# Altium schematic sheet DD2090_4CAM_FFC_TopLevel.SchDoc: =project_title
size Tabloid; PageSetup: Record=PageOptions|CenterHorizontal=True|CenterVertical=True|PrintScale=0.73|XCorrection=1.00|YCorrection=1.00|PrintKind=0|BorderSize=5000000|LeftOffset=0|BottomOffset=0|Orientation=2|PaperLength=1000|PaperWidth=1000|Scale=100|PaperSource=7|PrintQuality=-4|MediaType=1|DitherType=10|PaperKind=A4|PrintScaleMode=1; CompanyName: Luxonis Holding; Organization: Luxonis Holding; Address1: 1925 Harmony Park Drive; Address2: Westminster, CO; Address3: 80234; Address4: United States; SheetNumber: 1; SheetTotal: 12
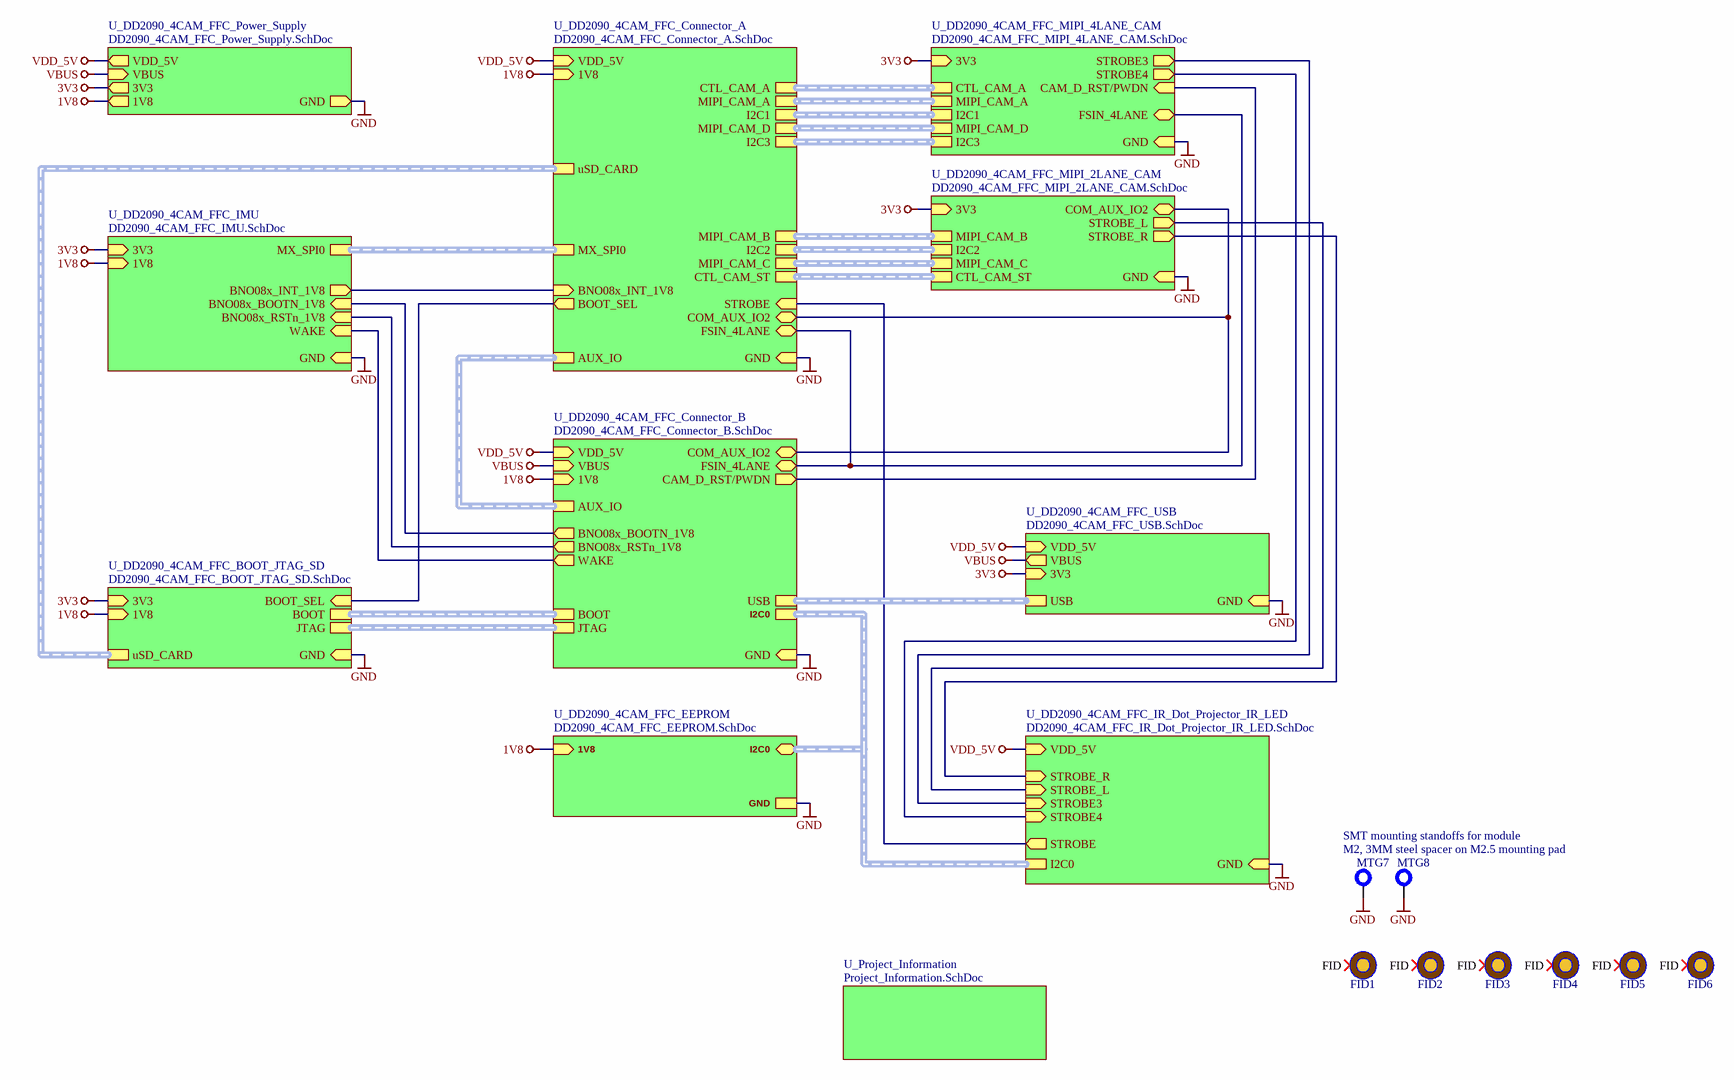
[diagram p0: DD2090_4CAM_FFC_TopLevel.SchDoc]

## Parts
FID1  FIDUCIAL_ROUND_1MM  [FIDUCIAL_ROUND_1MM]  (value not drawn)  (no BOM)
FID2  FIDUCIAL_ROUND_1MM  [FIDUCIAL_ROUND_1MM]  (value not drawn)  (no BOM)
FID3  FIDUCIAL_ROUND_1MM  [FIDUCIAL_ROUND_1MM]  (value not drawn)  (no BOM)
FID4  FIDUCIAL_ROUND_1MM  [FIDUCIAL_ROUND_1MM]  (value not drawn)  (no BOM)
FID5  FIDUCIAL_ROUND_1MM  [FIDUCIAL_ROUND_1MM]  (value not drawn)  (no BOM)
FID6  FIDUCIAL_ROUND_1MM  [FIDUCIAL_ROUND_1MM]  (value not drawn)  (no BOM)
MTG7  M2, 3MM steel spacer on M2.5 mounting pad  [9774030243R]
MTG8  M2, 3MM steel spacer on M2.5 mounting pad  [9774030243R]  (value not drawn)

## Sub-sheets
U_DD2090_4CAM_FFC_BOOT_JTAG_SD = DD2090_4CAM_FFC_BOOT_JTAG_SD.SchDoc: 1V8 (in), GND (in), 3V3 (in), JTAG (harness JTAG), BOOT (harness BOOT), uSD_CARD (harness uSD_CARD), BOOT_SEL (in)
U_DD2090_4CAM_FFC_Connector_A = DD2090_4CAM_FFC_Connector_A.SchDoc: VDD_5V (in), GND (in), 1V8 (in), MIPI_CAM_A (harness MIPI_CAM_A), I2C1 (harness I2C1), MIPI_CAM_B (harness MIPI_CAM_B), I2C2 (harness I2C2), MIPI_CAM_C (harness MIPI_CAM_C), MX_SPI0 (harness MX_SPI0), BNO08x_INT_1V8 (in), CTL_CAM_A (harness CTL_CAM_A), MIPI_CAM_D (harness MIPI_CAM_D), uSD_CARD (harness uSD_CARD), COM_AUX_IO2 (bidir), I2C3 (harness I2C3), AUX_IO (harness AUX_IO), FSIN_4LANE (bidir), BOOT_SEL (out), CTL_CAM_ST (harness CTL_CAM_ST), STROBE (in)
U_DD2090_4CAM_FFC_Connector_B = DD2090_4CAM_FFC_Connector_B.SchDoc: VDD_5V (in), GND (in), VBUS (in), 1V8 (in), USB (harness USB), BNO08x_RSTn_1V8 (out), BNO08x_BOOTN_1V8 (out), BOOT (harness BOOT), JTAG (harness JTAG), CAM_D_RST/PWDN (out), FSIN_4LANE (bidir), COM_AUX_IO2 (bidir), AUX_IO (harness AUX_IO), I2C0 (harness I2C0), WAKE (out)
U_DD2090_4CAM_FFC_EEPROM = DD2090_4CAM_FFC_EEPROM.SchDoc: 1V8 (in), GND, I2C0 (bidir, harness I2C0)
U_DD2090_4CAM_FFC_IMU = DD2090_4CAM_FFC_IMU.SchDoc: BNO08x_BOOTN_1V8 (in), GND (in), 3V3 (in), BNO08x_INT_1V8 (out), BNO08x_RSTn_1V8 (in), 1V8 (in), MX_SPI0 (harness MX_SPI0), WAKE (in)
U_DD2090_4CAM_FFC_IR_Dot_Projector_IR_LED = DD2090_4CAM_FFC_IR_Dot_Projector_IR_LED.SchDoc: I2C0 (harness I2C0), GND (in), VDD_5V (in), STROBE_L (in), STROBE_R (in), STROBE3 (in), STROBE4 (in), STROBE (out)
U_DD2090_4CAM_FFC_MIPI_2LANE_CAM = DD2090_4CAM_FFC_MIPI_2LANE_CAM.SchDoc: MIPI_CAM_B (harness MIPI_CAM_B), I2C2 (harness I2C), MIPI_CAM_C (harness MIPI_CAM_C), GND (in), 3V3 (in), CTL_CAM_ST (harness CTL_CAM_ST), COM_AUX_IO2 (bidir), STROBE_L (out), STROBE_R (out)
U_DD2090_4CAM_FFC_MIPI_4LANE_CAM = DD2090_4CAM_FFC_MIPI_4LANE_CAM.SchDoc: I2C1 (harness I2C1), MIPI_CAM_A (harness MIPI_CAM_A), CTL_CAM_A (harness CTL_CAM_A), GND (in), 3V3 (in), MIPI_CAM_D (harness MIPI_CAM_D), I2C3 (harness I2C3), CAM_D_RST/PWDN (in), FSIN_4LANE (bidir), STROBE3 (out), STROBE4 (out)
U_DD2090_4CAM_FFC_Power_Supply = DD2090_4CAM_FFC_Power_Supply.SchDoc: GND (out), 1V8 (out), VDD_5V (out), 3V3 (out), VBUS (in)
U_DD2090_4CAM_FFC_USB = DD2090_4CAM_FFC_USB.SchDoc: VBUS (out), GND (in), 3V3 (in), VDD_5V (in), USB (harness USB)
U_Project_Information = Project_Information.SchDoc: no entries

## Nets
1V8: sheet U_DD2090_4CAM_FFC_Power_Supply/1V8, sheet U_DD2090_4CAM_FFC_IMU/1V8, sheet U_DD2090_4CAM_FFC_BOOT_JTAG_SD/1V8, sheet U_DD2090_4CAM_FFC_Connector_A/1V8, sheet U_DD2090_4CAM_FFC_Connector_B/1V8, sheet U_DD2090_4CAM_FFC_EEPROM/1V8
3V3: sheet U_DD2090_4CAM_FFC_USB/3V3, sheet U_DD2090_4CAM_FFC_Power_Supply/3V3, sheet U_DD2090_4CAM_FFC_IMU/3V3, sheet U_DD2090_4CAM_FFC_BOOT_JTAG_SD/3V3, sheet U_DD2090_4CAM_FFC_MIPI_2LANE_CAM/3V3, sheet U_DD2090_4CAM_FFC_MIPI_4LANE_CAM/3V3
GND: MTG7.1 MTG8.1 ; sheet U_DD2090_4CAM_FFC_USB/GND, sheet U_DD2090_4CAM_FFC_Power_Supply/GND, sheet U_DD2090_4CAM_FFC_IMU/GND, sheet U_DD2090_4CAM_FFC_BOOT_JTAG_SD/GND, sheet U_DD2090_4CAM_FFC_MIPI_2LANE_CAM/GND, sheet U_DD2090_4CAM_FFC_MIPI_4LANE_CAM/GND, sheet U_DD2090_4CAM_FFC_Connector_A/GND, sheet U_DD2090_4CAM_FFC_Connector_B/GND, sheet U_DD2090_4CAM_FFC_EEPROM/GND, sheet U_DD2090_4CAM_FFC_IR_Dot_Projector_IR_LED/GND
VBUS: sheet U_DD2090_4CAM_FFC_USB/VBUS, sheet U_DD2090_4CAM_FFC_Power_Supply/VBUS, sheet U_DD2090_4CAM_FFC_Connector_B/VBUS
VDD_5V: sheet U_DD2090_4CAM_FFC_USB/VDD_5V, sheet U_DD2090_4CAM_FFC_Power_Supply/VDD_5V, sheet U_DD2090_4CAM_FFC_Connector_A/VDD_5V, sheet U_DD2090_4CAM_FFC_Connector_B/VDD_5V, sheet U_DD2090_4CAM_FFC_IR_Dot_Projector_IR_LED/VDD_5V
(unnamed): sheet U_DD2090_4CAM_FFC_IMU/BNO08x_BOOTN_1V8, sheet U_DD2090_4CAM_FFC_Connector_B/BNO08x_BOOTN_1V8
(unnamed): sheet U_DD2090_4CAM_FFC_IMU/BNO08x_INT_1V8, sheet U_DD2090_4CAM_FFC_Connector_A/BNO08x_INT_1V8
(unnamed): sheet U_DD2090_4CAM_FFC_IMU/BNO08x_RSTn_1V8, sheet U_DD2090_4CAM_FFC_Connector_B/BNO08x_RSTn_1V8
(unnamed): sheet U_DD2090_4CAM_FFC_IMU/WAKE, sheet U_DD2090_4CAM_FFC_Connector_B/WAKE
(unnamed): sheet U_DD2090_4CAM_FFC_BOOT_JTAG_SD/BOOT_SEL, sheet U_DD2090_4CAM_FFC_Connector_A/BOOT_SEL
(unnamed): sheet U_DD2090_4CAM_FFC_MIPI_2LANE_CAM/COM_AUX_IO2, sheet U_DD2090_4CAM_FFC_Connector_A/COM_AUX_IO2, sheet U_DD2090_4CAM_FFC_Connector_B/COM_AUX_IO2
(unnamed): sheet U_DD2090_4CAM_FFC_MIPI_2LANE_CAM/STROBE_L, sheet U_DD2090_4CAM_FFC_IR_Dot_Projector_IR_LED/STROBE_L
(unnamed): sheet U_DD2090_4CAM_FFC_MIPI_2LANE_CAM/STROBE_R, sheet U_DD2090_4CAM_FFC_IR_Dot_Projector_IR_LED/STROBE_R
(unnamed): sheet U_DD2090_4CAM_FFC_MIPI_4LANE_CAM/CAM_D_RST/PWDN, sheet U_DD2090_4CAM_FFC_Connector_B/CAM_D_RST/PWDN
(unnamed): sheet U_DD2090_4CAM_FFC_MIPI_4LANE_CAM/FSIN_4LANE, sheet U_DD2090_4CAM_FFC_Connector_A/FSIN_4LANE, sheet U_DD2090_4CAM_FFC_Connector_B/FSIN_4LANE
(unnamed): sheet U_DD2090_4CAM_FFC_MIPI_4LANE_CAM/STROBE3, sheet U_DD2090_4CAM_FFC_IR_Dot_Projector_IR_LED/STROBE3
(unnamed): sheet U_DD2090_4CAM_FFC_MIPI_4LANE_CAM/STROBE4, sheet U_DD2090_4CAM_FFC_IR_Dot_Projector_IR_LED/STROBE4
(unnamed): sheet U_DD2090_4CAM_FFC_Connector_A/STROBE, sheet U_DD2090_4CAM_FFC_IR_Dot_Projector_IR_LED/STROBE

Not connected (* = marked no-connect by the designer): FID1 FID*; FID2 FID*; FID3 FID*; FID4 FID*; FID5 FID*; FID6 FID*

## Buses and harness runs
harness sheet U_DD2090_4CAM_FFC_BOOT_JTAG_SD/BOOT = sheet U_DD2090_4CAM_FFC_Connector_B/BOOT
harness sheet U_DD2090_4CAM_FFC_BOOT_JTAG_SD/JTAG = sheet U_DD2090_4CAM_FFC_Connector_B/JTAG
harness sheet U_DD2090_4CAM_FFC_BOOT_JTAG_SD/uSD_CARD = sheet U_DD2090_4CAM_FFC_Connector_A/uSD_CARD
harness sheet U_DD2090_4CAM_FFC_Connector_A/AUX_IO = sheet U_DD2090_4CAM_FFC_Connector_B/AUX_IO
harness sheet U_DD2090_4CAM_FFC_Connector_A/CTL_CAM_A = sheet U_DD2090_4CAM_FFC_MIPI_4LANE_CAM/CTL_CAM_A
harness sheet U_DD2090_4CAM_FFC_Connector_A/CTL_CAM_ST = sheet U_DD2090_4CAM_FFC_MIPI_2LANE_CAM/CTL_CAM_ST
harness sheet U_DD2090_4CAM_FFC_Connector_A/I2C1 = sheet U_DD2090_4CAM_FFC_MIPI_4LANE_CAM/I2C1
harness sheet U_DD2090_4CAM_FFC_Connector_A/I2C2 = sheet U_DD2090_4CAM_FFC_MIPI_2LANE_CAM/I2C2
harness sheet U_DD2090_4CAM_FFC_Connector_A/I2C3 = sheet U_DD2090_4CAM_FFC_MIPI_4LANE_CAM/I2C3
harness sheet U_DD2090_4CAM_FFC_Connector_A/MIPI_CAM_A = sheet U_DD2090_4CAM_FFC_MIPI_4LANE_CAM/MIPI_CAM_A
harness sheet U_DD2090_4CAM_FFC_Connector_A/MIPI_CAM_B = sheet U_DD2090_4CAM_FFC_MIPI_2LANE_CAM/MIPI_CAM_B
harness sheet U_DD2090_4CAM_FFC_Connector_A/MIPI_CAM_C = sheet U_DD2090_4CAM_FFC_MIPI_2LANE_CAM/MIPI_CAM_C
harness sheet U_DD2090_4CAM_FFC_Connector_A/MIPI_CAM_D = sheet U_DD2090_4CAM_FFC_MIPI_4LANE_CAM/MIPI_CAM_D
harness sheet U_DD2090_4CAM_FFC_Connector_A/MX_SPI0 = sheet U_DD2090_4CAM_FFC_IMU/MX_SPI0
harness sheet U_DD2090_4CAM_FFC_Connector_B/I2C0 = sheet U_DD2090_4CAM_FFC_EEPROM/I2C0 = sheet U_DD2090_4CAM_FFC_IR_Dot_Projector_IR_LED/I2C0
harness sheet U_DD2090_4CAM_FFC_Connector_B/USB = sheet U_DD2090_4CAM_FFC_USB/USB

## Notes on the sheet
- SMT mounting standoffs for module
- Title
- Size:
- Date:
- Tabloid
- Number:
- Time:
- Revision:
- Sheet
- of
- Drawn by:

## Library data of the parts
FID1-FID6 = FIDUCIAL: Fiducial with various available footprints
MTG7 MTG8 = 9774030243R: MP ROUND STANDOFF M2X0.4 STEEL 3MM; Manufacturer 1: Wurth Electronics; Plating: Tin; Threaded/Unthreaded: Threaded; Outside Diameter: 0.171inch; Supplier 1: Digi-Key; Manufacturer Part Number 1: 9774030243R; Stock 1: 20568; Pricing 1: 1=0.95000, 10=0.91800, 50=0.79500, 100=0.73900 (USD); RoHS: Yes; Material: Steel; Length: 0.173inch; REACH SVHC: Unknown; ComponentLink1URL: http://www.mouser.com/ds/2/445/9774030243R-611455.pdf?src-supplier=Mouser; ComponentLink1Description: http://www.mouser.com/ds/2/445/9774030243R-611455.pdf?src-supplier=Mouser; ComponentLink2URL: http://www.farnell.com/datasheets/1960368.pdf?src-supplier=Farnell; ComponentLink2Description: http://www.farnell.com/datasheets/1960368.pdf?src-supplier=Farnell; ComponentLink3URL: https://katalog.we-online.de/em/datasheet/9774030243R.pdf?src-supplier=Digi-Key; ComponentLink3Description: https://katalog.we-online.de/em/datasheet/9774030243R.pdf?src-supplier=Digi-Key; ComponentLink4URL: http://www.farnell.com/datasheets/1960368.pdf?src-supplier=Newark; ComponentLink4Description: http://www.farnell.com/datasheets/1960368.pdf?src-supplier=Newark; ComponentLink5URL: http://www.farnell.com/datasheets/1960368.pdf?src-supplier=Element14; ComponentLink5Description: http://www.farnell.com/datasheets/1960368.pdf?src-supplier=Element14; Supplier Part Number 1: 732-7085-1-ND; Supplier 2: Mouser; Supplier Part Number 2: 710-9774030243R; Supplier 3: Element14; Supplier Part Number 3: 2497599